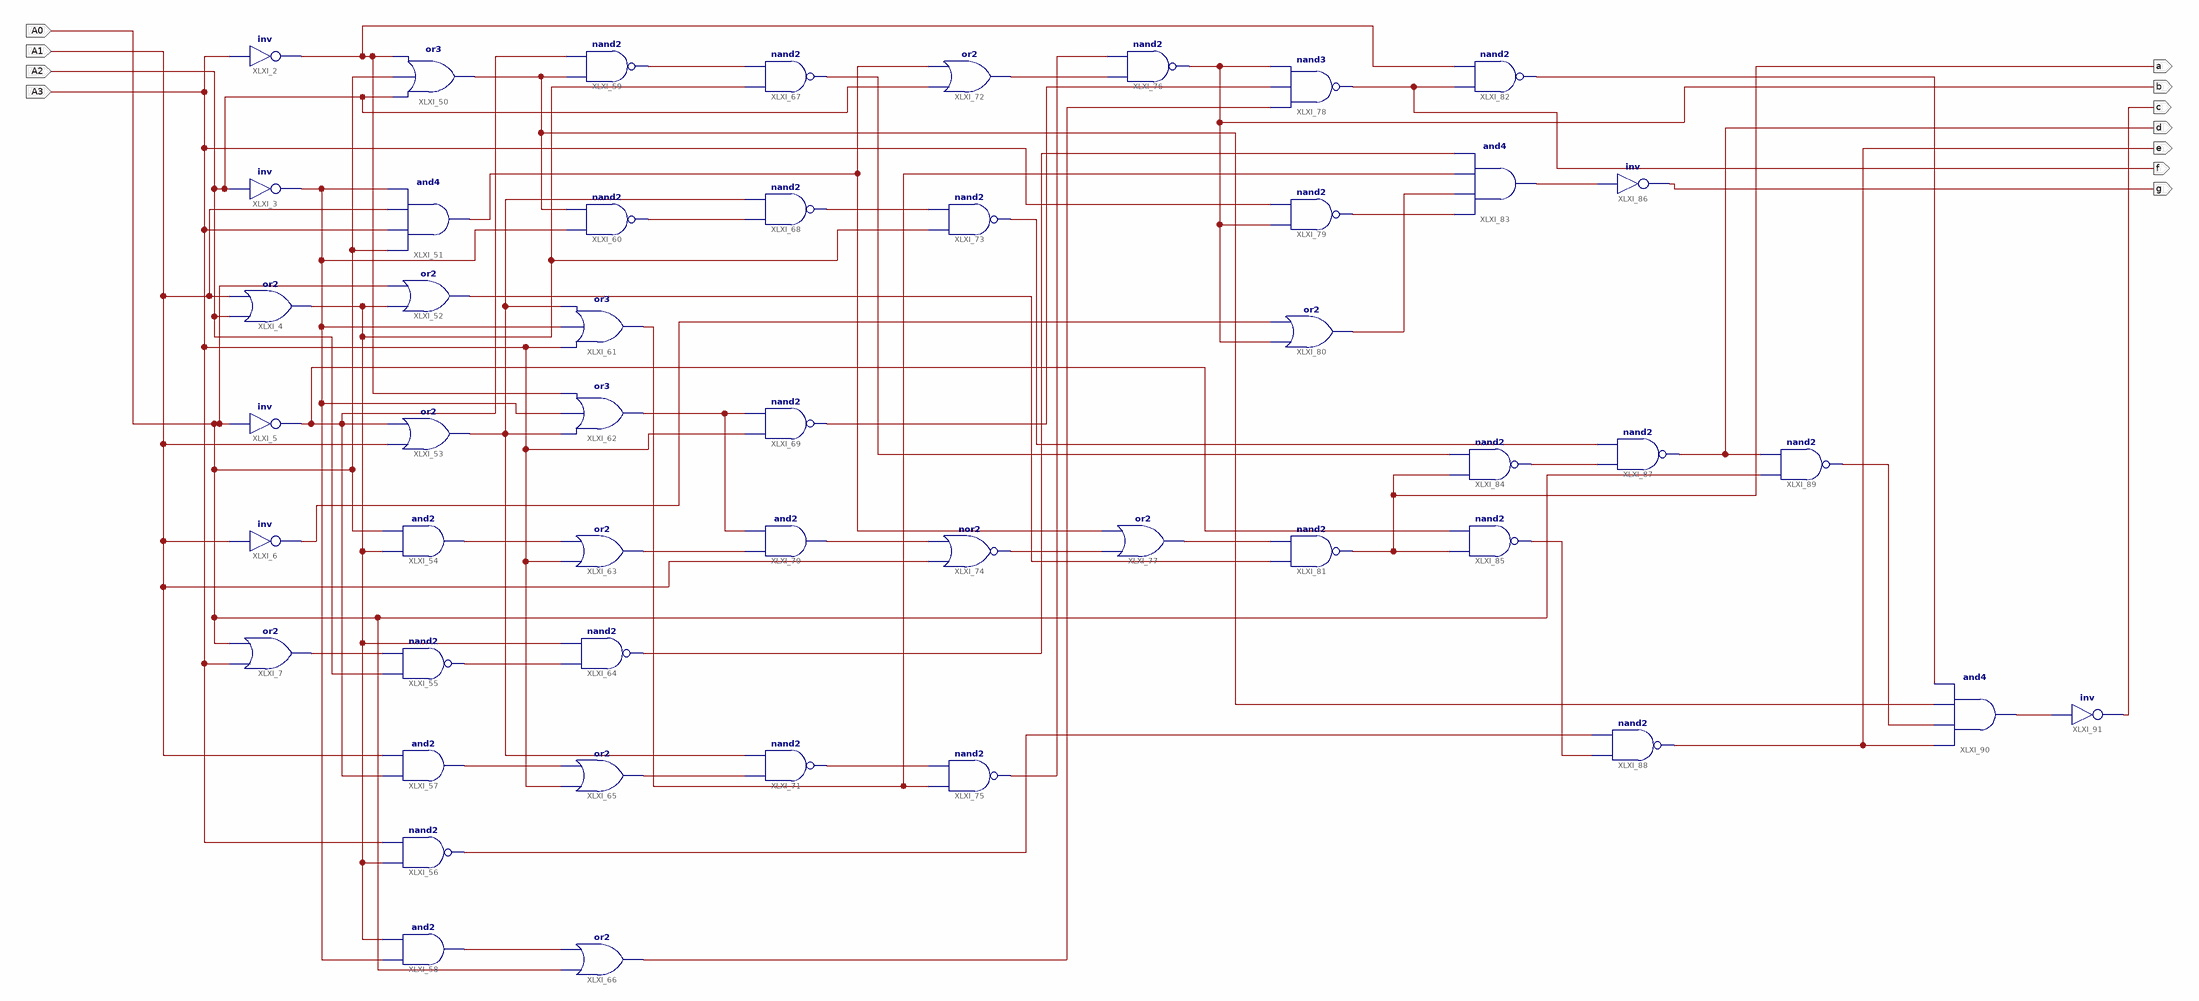
[diagram p0: schematic sheet 1]
// Xilinx ISE schematic ssd1d0f.sch (spartan6) as structural Verilog: 48 symbols, 11 ports
module ssd1d0f (
  input  A1,
  input  A0,
  input  A3,
  input  A2,
  output a,
  output b,
  output e,
  output d,
  output g,
  output f,
  output c
);

  wire XLXN_26, XLXN_30, XLXN_35, XLXN_37, XLXN_40, XLXN_41, XLXN_43, XLXN_44, XLXN_46, XLXN_47, XLXN_48,
       XLXN_49, XLXN_51, XLXN_52, XLXN_54, XLXN_55, XLXN_56, XLXN_57, XLXN_58, XLXN_59, XLXN_61, XLXN_62,
       XLXN_63, XLXN_65, XLXN_67, XLXN_68, XLXN_71, XLXN_72, XLXN_74, XLXN_75, XLXN_77, XLXN_78, XLXN_79,
       XLXN_82, XLXN_83, XLXN_84, XLXN_85, XLXN_86, XLXN_88, XLXN_90, XLXN_91;

  not XLXI_2 (XLXN_40, A3);
  not XLXI_3 (XLXN_35, A2);
  or XLXI_4 (XLXN_57, A2, A1);
  not XLXI_5 (XLXN_30, A0);
  not XLXI_6 (XLXN_71, A1);
  or XLXI_7 (XLXN_26, A3, A0);
  and XLXI_51 (XLXN_55, A0, A3, A1, XLXN_35);
  or XLXI_52 (XLXN_72, XLXN_57, A0);
  or XLXI_53 (XLXN_49, A1, XLXN_30);
  and XLXI_54 (XLXN_41, XLXN_57, A0);
  nand XLXI_55 (XLXN_43, A2, XLXN_26);
  and XLXI_57 (XLXN_44, XLXN_30, A1);
  nand XLXI_56 (XLXN_85, XLXN_57, A3);
  and XLXI_58 (XLXN_46, XLXN_35, XLXN_57);
  or XLXI_50 (XLXN_37, A2, A0, XLXN_40);
  nand XLXI_59 (XLXN_47, XLXN_37, XLXN_30);
  nand XLXI_60 (XLXN_48, XLXN_35, XLXN_37);
  or XLXI_61 (XLXN_77, A3, XLXN_35, XLXN_49);
  or XLXI_62 (XLXN_52, XLXN_49, XLXN_35, XLXN_40);
  or XLXI_63 (XLXN_51, A3, XLXN_41);
  nand XLXI_64 (XLXN_78, XLXN_43, XLXN_57);
  or XLXI_65 (XLXN_54, A3, XLXN_44);
  or XLXI_66 (XLXN_68, A0, XLXN_46);
  nand XLXI_67 (XLXN_79, XLXN_57, XLXN_47);
  nand XLXI_68 (XLXN_56, XLXN_48, XLXN_49);
  nand XLXI_69 (XLXN_67, A3, XLXN_52);
  and XLXI_70 (XLXN_58, XLXN_51, XLXN_52);
  nand XLXI_71 (XLXN_59, XLXN_54, XLXN_49);
  or XLXI_72 (XLXN_62, A2, XLXN_55);
  nand XLXI_73 (XLXN_84, XLXN_57, XLXN_56);
  nor XLXI_74 (XLXN_61, A1, XLXN_58);
  nand XLXI_75 (XLXN_63, XLXN_77, XLXN_59);
  nand XLXI_76 (b, XLXN_62, XLXN_63);
  or XLXI_77 (XLXN_65, XLXN_61, XLXN_55);
  nand XLXI_78 (f, XLXN_68, XLXN_67, b);
  nand XLXI_79 (XLXN_74, b, A3);
  or XLXI_80 (XLXN_75, b, XLXN_71);
  nand XLXI_81 (a, XLXN_72, XLXN_65);
  nand XLXI_82 (XLXN_90, f, XLXN_40);
  and XLXI_83 (XLXN_82, XLXN_74, XLXN_75, XLXN_77, XLXN_78);
  nand XLXI_84 (XLXN_83, a, XLXN_79);
  nand XLXI_85 (XLXN_86, a, XLXN_30);
  nand XLXI_87 (d, XLXN_83, XLXN_84);
  not XLXI_86 (g, XLXN_82);
  nand XLXI_88 (e, XLXN_86, XLXN_85);
  nand XLXI_89 (XLXN_88, A0, d);
  and XLXI_90 (XLXN_91, e, XLXN_88, XLXN_37, XLXN_90);
  not XLXI_91 (c, XLXN_91);
endmodule
